# EAGLE design Dash Lights (EAGLE 8.4.1)
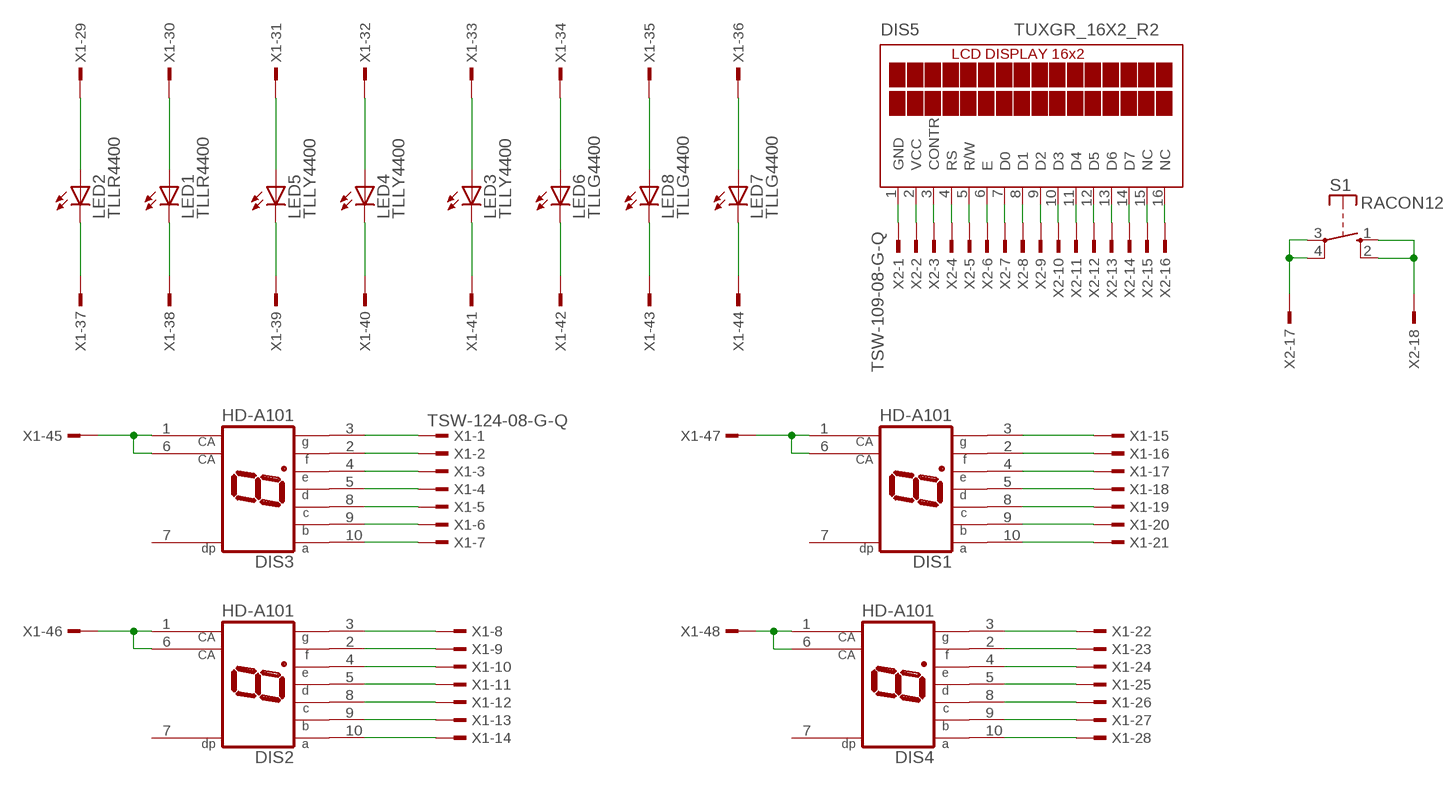
[diagram p0: schematic, sheet 1]

## Parts
DIS1  HD-A101  [HDSP-A]
DIS2  HD-A101  [HDSP-A]
DIS3  HD-A101  [HDSP-A]
DIS4  HD-A101  [HDSP-A]
DIS5  TUXGR_16X2_R2  [TUXGR_16X2_R2]
LED1  TLLR4400  [LED3MM]
LED2  TLLR4400  [LED3MM]
LED3  TLLY4400  [LED3MM]
LED4  TLLY4400  [LED3MM]
LED5  TLLY4400  [LED3MM]
LED6  TLLG4400  [LED3MM]
LED7  TLLG4400  [LED3MM]
LED8  TLLG4400  [LED3MM]
S1  RACON12  [RACON12]
X1  TSW-124-08-G-Q  [TSW-124-XX-G-Q]
X2  TSW-109-08-G-Q  [TSW-109-XX-G-Q]

## Nets
N$1: DIS3.3(G) X1.1
N$2: DIS3.2(F) X1.2
N$3: DIS3.4(E) X1.3
N$4: DIS3.5(D) X1.4
N$5: DIS3.8(C) X1.5
N$6: DIS3.9(B) X1.6
N$7: DIS3.10(A) X1.7
N$8: DIS2.3(G) X1.8
N$9: DIS2.2(F) X1.9
N$10: DIS2.4(E) X1.10
N$11: DIS2.5(D) X1.11
N$12: DIS2.8(C) X1.12
N$13: DIS2.9(B) X1.13
N$14: DIS2.10(A) X1.14
N$15: DIS1.3(G) X1.15
N$16: DIS1.2(F) X1.16
N$17: DIS1.4(E) X1.17
N$18: DIS1.5(D) X1.18
N$19: DIS1.8(C) X1.19
N$20: DIS1.9(B) X1.20
N$21: DIS1.10(A) X1.21
N$22: DIS4.3(G) X1.22
N$23: DIS4.2(F) X1.23
N$24: DIS4.4(E) X1.24
N$25: DIS4.5(D) X1.25
N$26: DIS4.8(C) X1.26
N$27: DIS4.9(B) X1.27
N$28: DIS4.10(A) X1.28
N$29: LED2.A X1.29
N$30: LED2.K(C) X1.37
N$31: LED1.K(C) X1.38
N$32: LED1.A X1.30
N$33: LED5.A X1.31
N$34: LED5.K(C) X1.39
N$35: LED4.A X1.32
N$36: LED4.K(C) X1.40
N$37: LED3.K(C) X1.41
N$38: LED3.A X1.33
N$39: LED6.A X1.34
N$40: LED6.K(C) X1.42
N$41: LED8.K(C) X1.43
N$42: LED7.K(C) X1.44
N$43: LED7.A X1.36
N$44: LED8.A X1.35
N$45: DIS3.1(CA) DIS3.6(CA) X1.45
N$46: DIS2.1(CA) DIS2.6(CA) X1.46
N$47: DIS1.1(CA) DIS1.6(CA) X1.47
N$48: DIS5.1(GND) X2.1
N$49: DIS5.2(VCC) X2.2
N$50: DIS5.3(CONTR) X2.3
N$51: DIS4.1(CA) DIS4.6(CA) X1.48
N$52: DIS5.4(RS) X2.4
N$53: DIS5.5(R/W) X2.5
N$54: DIS5.6(E) X2.6
N$55: DIS5.7(D0) X2.7
N$56: DIS5.8(D1) X2.8
N$57: DIS5.9(D2) X2.9
N$58: DIS5.10(D3) X2.10
N$59: DIS5.11(D4) X2.11
N$60: DIS5.12(D5) X2.12
N$61: DIS5.13(D6) X2.13
N$62: DIS5.14(D7) X2.14
N$63: DIS5.15(NC) X2.15
N$64: DIS5.16(NC) X2.16
N$65: S1.3(P) S1.4(P) X2.17
N$66: S1.1(S) S1.2(S) X2.18
Unconnected: DIS1.7(DP) DIS2.7(DP) DIS3.7(DP) DIS4.7(DP)

## Library data of the parts
DIS1-DIS4 = display-hp:HD-A101: LED DISPLAY 1-character 7 segment, decimal point right; OC_FARNELL: unknown; OC_NEWARK: unknown
DIS5 = display-lcd:TUXGR_16X2_R2: Tuxgraphics LCD display 16x2 characters reflective, without background light Source: tuxgr_12x2_r2.pdf; OC_FARNELL: unknown; OC_NEWARK: unknown
LED1 LED2 = led:TLLR4400: Low Current (2mA) LED 3 mm Tinted Diffused Package color RED Source: Data sheet <http://www.farnell.com/datasheets/391100.pdf>; MF: VISHAY SEMICONDUCTOR; OC_FARNELL: 1612437
LED3-LED5 = led:TLLY4400: Low Current (2mA) LED 3 mm Tinted Diffused Package color YELLOW Source: Data sheet <http://www.farnell.com/datasheets/391098.pdf>; MF: VISHAY SEMICONDUCTOR; OC_FARNELL: 1612439
LED6-LED8 = led:TLLG4400: Low Current (2mA) LED 3 mm Tinted Diffused Package color GREEN Source: Data sheet <http://www.farnell.com/datasheets/391098.pdf>; MF: VISHAY SEMICONDUCTOR; OC_FARNELL: 1612435
S1 = switch-misc:RACON12: ITT SWITCH
X1 = con-samtec:TSW-124-*-G: THROUGH-HOLE .025" SQ POST HEADER Source: Samtec TSW.pdf; MF: Samtec Inc.; MPN: TSW-124-07-G-Q
X2 = con-samtec:TSW-109-*-G: THROUGH-HOLE .025" SQ POST HEADER Source: Samtec TSW.pdf; MF: Samtec Inc.; MPN: TSW-109-07-G-Q

## Board
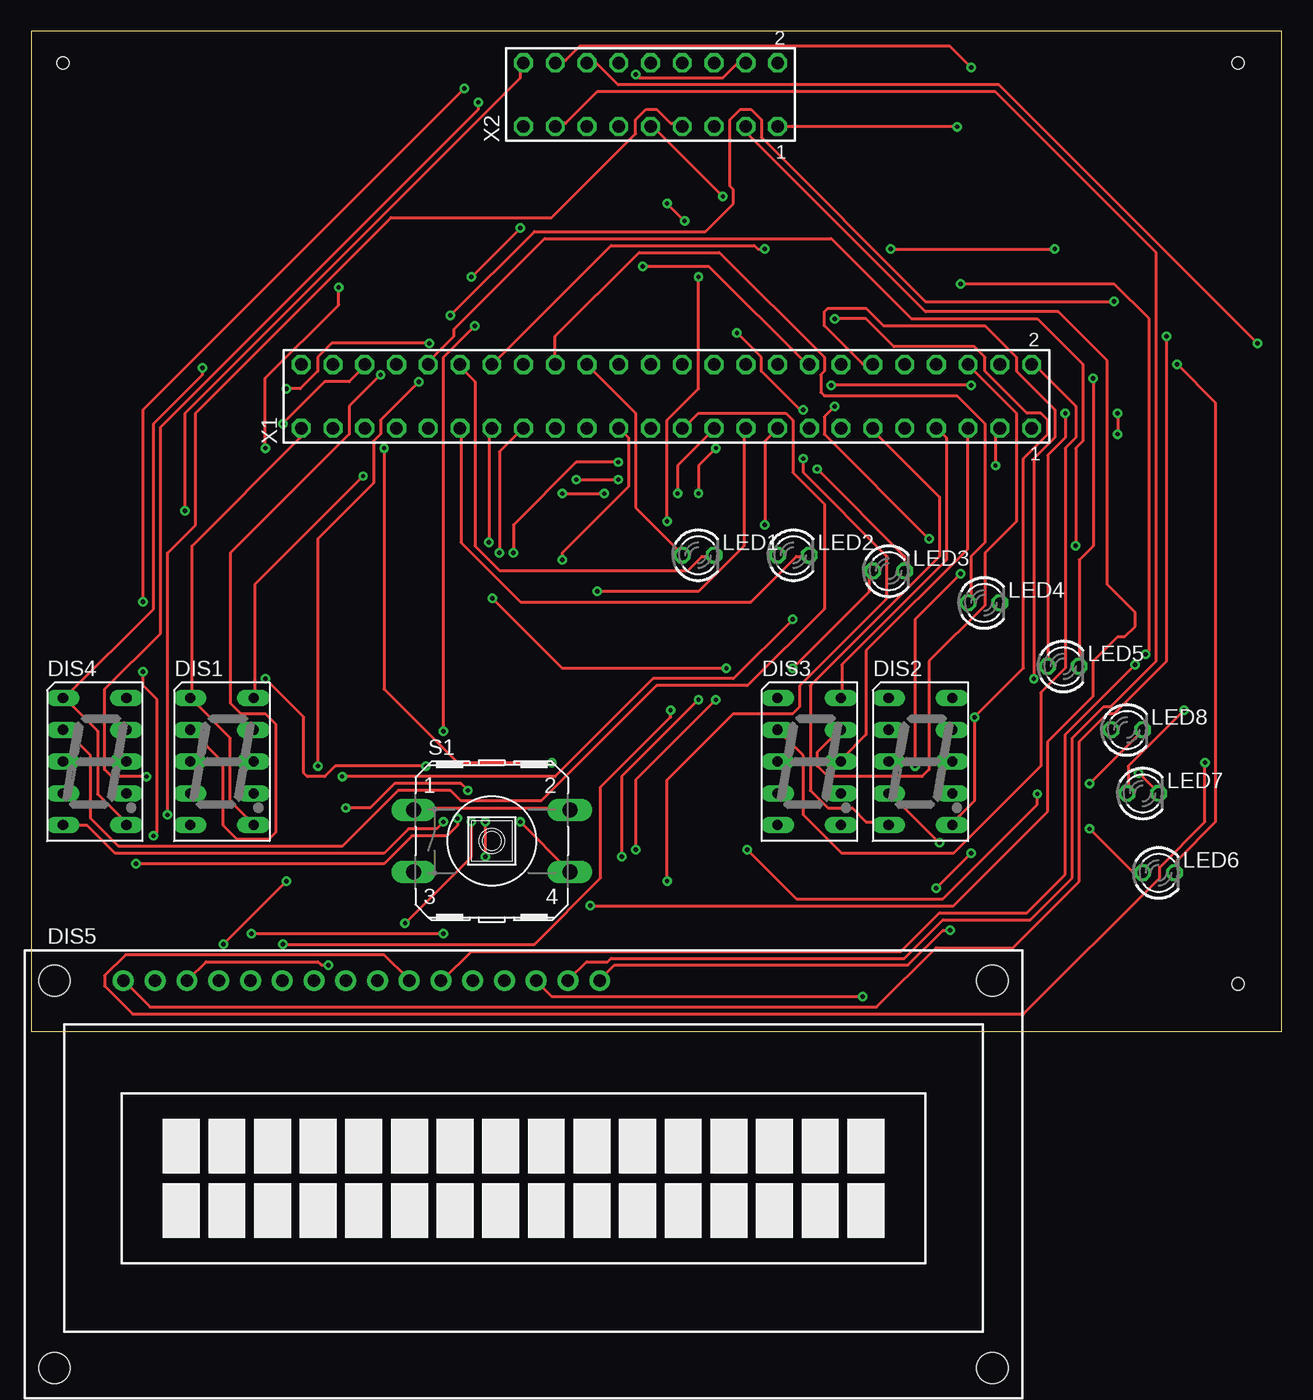
[diagram p1: board, top side]
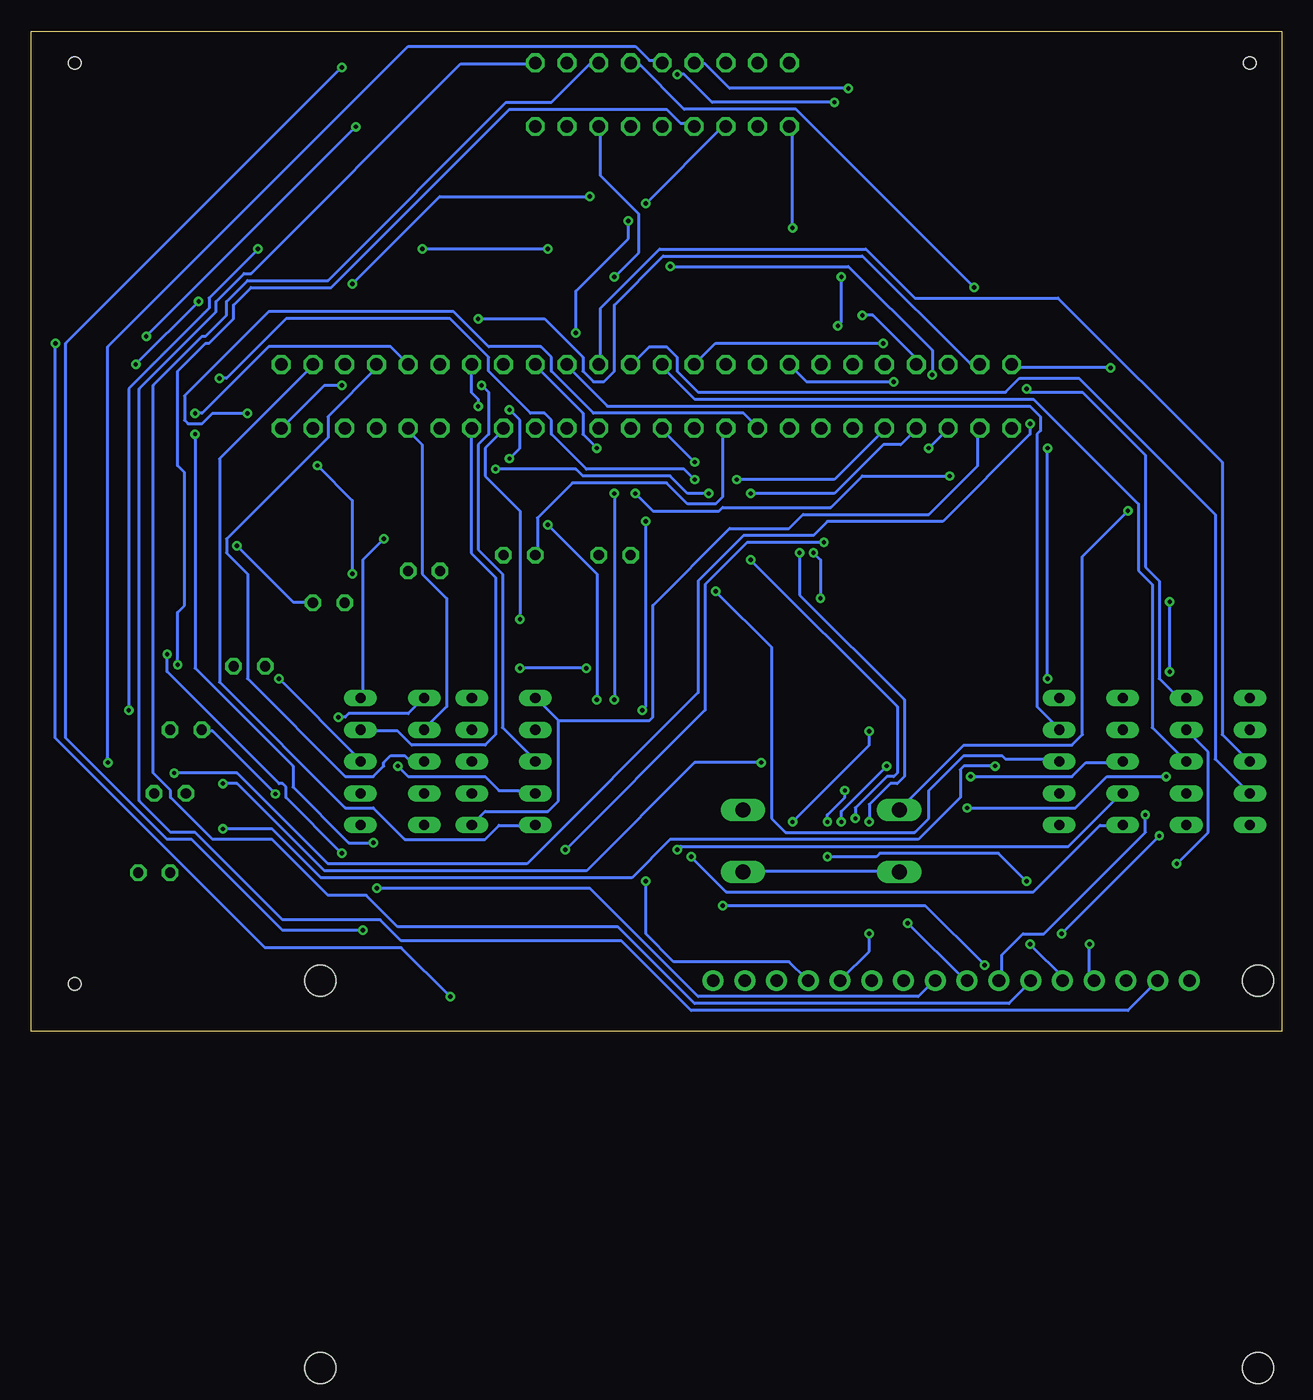
[diagram p2: board, bottom side, seen from below]

Size 100 x 80 mm. Coordinates in mm from the lower left corner, seen from the top.
Outline: 0,0 100,0 100,80 0,80 0,0
Copper layers (1*16): Top 0.035mm / dielectric 1.5mm / Bottom 0.035mm
Design rules "default *": minimum track width 10mil, minimum drill 0.35mm, track to track 12mil, track to pad 12mil, pad to pad 12mil, via to via 12mil, smd to smd 6mil, copper to edge 40mil, drill to drill 6mil, minimum pad ring 10mil, minimum via ring 8mil, stop-mask expansion 4mil, vias tented up to drill 0mil, thermal gap 10mil
Holes 1 mm at 2.54,77.47 96.52,77.47 96.52,3.81

### Footprints (pad centres in the part's own frame; a part is rotated, then mirrored left to right if it is on the bottom)
HDSP-A = drill 0.813 long: 1 -2.54,5.08; 2 -2.54,2.54; 3 -2.54,0; 4 -2.54,-2.54; 5 -2.54,-5.08; 6 2.54,-5.08; 7 2.54,-2.54; 8 2.54,0; 9 2.54,2.54; 10 2.54,5.08
TUXGR_16X2_R2 = drill 1 pad 1.676: 1 -32,15.5; 2 -29.46,15.5; 3 -26.92,15.5; 4 -24.38,15.5; 5 -21.84,15.5; 6 -19.3,15.5; 7 -16.76,15.5; 8 -14.22,15.5; 9 -11.68,15.5; 10 -9.14,15.5; 11 -6.6,15.5; 12 -4.06,15.5; 13 -1.52,15.5; 14 1.02,15.5; 15 3.56,15.5; 16 6.1,15.5 | hole 2.5: -37.5,-15.5; 37.5,-15.5; -37.5,15.5; 37.5,15.5
LED3MM = drill 0.813 octagon: A -1.27,0; K 1.27,0
RACON12 = drill 1.194 long: 1 -6.248,2.489; 2 6.248,2.489; 3 -6.248,-2.489; 4 6.248,-2.489
TSW-124-XX-G-Q = drill 1 pad 1.5 octagon: 1 29.21,-2.54; 2 29.21,2.54; 3 26.67,-2.54; 4 26.67,2.54; 5 24.13,-2.54; 6 24.13,2.54; 7 21.59,-2.54; 8 21.59,2.54; 9 19.05,-2.54; 10 19.05,2.54; 11 16.51,-2.54; 12 16.51,2.54; 13 13.97,-2.54; 14 13.97,2.54; 15 11.43,-2.54; 16 11.43,2.54; 17 8.89,-2.54; 18 8.89,2.54; 19 6.35,-2.54; 20 6.35,2.54; 21 3.81,-2.54; 22 3.81,2.54; 23 1.27,-2.54; 24 1.27,2.54; 25 -1.27,-2.54; 26 -1.27,2.54; 27 -3.81,-2.54; 28 -3.81,2.54; 29 -6.35,-2.54; 30 -6.35,2.54; 31 -8.89,-2.54; 32 -8.89,2.54; 33 -11.43,-2.54; 34 -11.43,2.54; 35 -13.97,-2.54; 36 -13.97,2.54; 37 -16.51,-2.54; 38 -16.51,2.54; 39 -19.05,-2.54; 40 -19.05,2.54; 41 -21.59,-2.54; 42 -21.59,2.54; 43 -24.13,-2.54; 44 -24.13,2.54; 45 -26.67,-2.54; 46 -26.67,2.54; 47 -29.21,-2.54; 48 -29.21,2.54
TSW-109-XX-G-Q = drill 1 pad 1.5 octagon: 1 10.16,-2.54; 2 10.16,2.54; 3 7.62,-2.54; 4 7.62,2.54; 5 5.08,-2.54; 6 5.08,2.54; 7 2.54,-2.54; 8 2.54,2.54; 9 0,-2.54; 10 0,2.54; 11 -2.54,-2.54; 12 -2.54,2.54; 13 -5.08,-2.54; 14 -5.08,2.54; 15 -7.62,-2.54; 16 -7.62,2.54; 17 -10.16,-2.54; 18 -10.16,2.54

### Placement (x,y rotation side)
DIS1  15.24,21.59 0 top
DIS2  71.12,21.59 0 top
DIS3  62.23,21.59 0 top
DIS4  5.08,21.59 0 top
DIS5  39.37,-11.43 0 top
LED1  53.34,38.1 0 top
LED2  60.96,38.1 0 top
LED3  68.58,36.83 0 top
LED4  76.2,34.29 0 top
LED5  82.55,29.21 0 top
LED6  90.17,12.7 0 top
LED7  88.9,19.05 0 top
LED8  87.63,24.13 0 top
S1  36.83,15.24 0 top
X1  50.8,50.8 0 top
X2  49.53,74.93 0 top

### Tracks (layer width: path | path; a pad name or v marks a point on that pad's centre or on a via)
N$1  (via drill 0.35)
  Top 0.254: v75.16,51.69 v63.98,51.69
  Bottom 0.254: v63.98,51.69 63.42,51.13 63.42,47.78 64.26,46.94 64.26,38.56 62.31,36.6 62.31,24.31 59.79,21.79 DIS3.3 | v75.16,51.69 76.56,51.69 79.91,48.34 X1.1
N$2
  Top 0.254: DIS3.2 61.75,22.07 61.75,17.32 64.82,14.25 73.76,14.25 80.75,21.23 80.75,27.1 82.7,29.06 82.7,46.66 83.54,47.5 83.54,50.01 80.19,53.37 X1.2
N$3  (via drill 0.35)
  Top 0.254: v70.69,21.23 70.69,32.97 v74.32,36.6 | v77.11,45.26 77.11,47.78 77.39,48.06 X1.3
  Bottom 0.254: v70.69,21.23 69.85,20.4 63.7,20.4 62.59,19.28 59.79,19.28 DIS3.4 | v74.32,36.6 74.32,42.47 v77.11,45.26
N$4
  Bottom 0.254: DIS3.5 59.79,16.48 62.59,16.48 63.7,15.37 70.13,15.37 72.64,17.88 74.88,17.88 84.94,27.94 84.94,45.82 77.67,53.09 X1.4
N$5
  Top 0.254: DIS3.8 64.82,21.79 66.78,23.75 66.78,30.45 74.88,38.56 74.88,48.06 X1.5
N$6
  Top 0.254: DIS3.9 64.54,24.03 62.87,22.35 62.87,21.23 63.7,20.4 71.25,20.4 71.81,20.95 71.81,29.62 76.28,34.09 76.28,38.28 78.79,40.79 78.79,49.45 75.16,53.09 X1.6
N$7
  Top 0.254: DIS3.10 64.82,26.82 64.82,29.34 73.2,37.72 73.2,47.5 72.64,48.06 X1.7
N$8
  Bottom 0.254: DIS2.3 68.73,21.79 69.85,21.79 70.13,22.07 71.25,22.07 71.81,21.51 71.81,21.23 72.64,20.4 74.88,20.4 82.7,28.22 82.7,36.6 84.38,38.28 84.38,39.4 76.28,47.5 76.28,49.17 72.36,53.09 X1.8
N$9
  Bottom 0.254: DIS2.2 68.45,24.31 66.78,25.98 66.78,34.65 68.73,36.6 68.73,46.94 69.85,48.06 X1.9
N$10  (via drill 0.35)
  Top 0.254: v72.64,15.09 68.73,19 DIS2.4 | v86.89,49.45 v86.89,47.78
  Bottom 0.254: v72.64,15.09 74.6,15.09 79.07,19.56 79.07,21.23 86.89,29.06 v86.89,47.78 | v86.89,49.45 86.33,49.45 81.03,54.76 71.25,54.76 69.85,53.37 X1.10
N$11
  Top 0.254: DIS2.5 68.45,16.76 66.78,16.76 65.66,17.88 63.7,17.88 62.31,19.28 62.31,27.66 72.64,38 72.64,42.75 67.33,48.06 X1.11
N$12  (via drill 0.35)
  Top 0.254: v80.19,28.22 80.19,45.82 81.86,47.5 81.86,49.73 78.79,52.81 78.79,53.92 76.28,56.44 68.17,56.44 66.78,57.84 63.7,57.84 63.42,57.56 63.42,56.44 66.5,53.37 67.06,53.37 X1.12
  Bottom 0.254: v80.19,28.22 73.76,21.79 DIS2.8
N$13
  Bottom 0.254: DIS2.9 73.48,24.03 70.69,24.03 69.57,22.91 63.7,22.91 62.87,23.75 62.87,36.32 64.82,38.28 64.82,48.06 X1.13
N$14  (via drill 0.35)
  Top 0.254: v71.81,39.4 63.42,47.78 63.42,49.17 v64.26,50.01
  Bottom 0.254: v71.81,39.4 73.48,37.72 73.48,26.82 DIS2.10 | v64.26,50.01 64.26,50.57 64.82,51.13 64.82,53.09 X1.14
N$15  (via drill 0.35)
  Top 0.254: v24.87,20.4 41.91,20.4 49.73,28.22 56.16,28.22 v60.91,32.97
  Bottom 0.254: v24.87,20.4 16.76,20.4 15.65,21.51 12.85,21.51 DIS1.3 | v60.91,32.97 60.91,41.63 63.7,44.42 63.7,46.66 62.31,48.06 X1.15
N$16  (via drill 0.35)
  Top 0.254: v27.94,52.53 25.43,50.01 25.43,47.78 15.93,38.28 15.93,26.26 16.76,25.43 18.72,25.43 19.56,24.59 19.56,15.93 19,15.37 16.48,15.37 15.37,16.48 15.37,21.51 12.85,24.03 DIS1.2 | v48.9,61.19 54.2,61.19 62.03,53.37 X1.16
  Bottom 0.254: v27.94,52.53 27.94,54.48 34.65,61.19 v48.9,61.19
N$17  (via drill 0.35)
  Top 0.254: v48.34,14.53 48.34,20.12 v54.76,26.54 | v58.67,40.51 58.67,47.22 59.51,48.06 X1.17
  Bottom 0.254: v48.34,14.53 48.06,14.81 17.04,14.81 12.85,19 DIS1.4 | v54.76,26.54 54.76,36.6 v58.67,40.51
N$18  (via drill 0.35)
  Top 0.254: v47.22,13.97 47.22,20.4 v53.37,26.54 | v53.37,43.03 53.37,45.26 v54.76,46.66
  Bottom 0.254: v47.22,13.97 44.42,11.18 19.84,11.18 14.53,16.48 12.85,16.48 DIS1.5 | v53.37,43.03 v53.37,26.54 | v54.76,46.66 55.88,47.78 55.88,49.45 59.51,53.09 X1.18
N$19  (via drill 0.35)
  Top 0.254: v45.26,35.2 53.37,35.2 57,38.84 57,48.06 X1.19
  Bottom 0.254: v45.26,35.2 40.79,30.73 40.79,17.04 39.67,15.93 29.34,15.93 28.22,17.04 28.22,19.28 25.43,22.07 22.35,22.07 22.07,21.79 17.88,21.79 DIS1.8
N$20
  Bottom 0.254: DIS1.9 17.88,24.31 19.56,25.98 19.56,47.78 19.28,48.06 19.28,49.17 20.12,50.01 53.92,50.01 57,53.09 X1.20
N$21  (via drill 0.35)
  Top 0.254: v26.54,44.42 17.88,35.76 17.88,26.82 DIS1.10 | v51.69,43.03 51.69,45.26 54.48,48.06 X1.21
  Bottom 0.254: v26.54,44.42 33.53,44.42 36.04,41.91 44.7,41.91 44.98,41.63 50.29,41.63 v51.69,43.03
N$22
  Bottom 0.254: DIS4.3 2.79,21.79 4.75,23.75 4.75,45.54 17.88,58.67 29.34,58.67 33.25,62.59 49.73,62.59 54.48,57.84 54.48,53.37 X1.22
N$23
  Top 0.254: DIS4.2 2.79,24.03 4.75,22.07 4.75,17.04 6.99,14.81 24.87,14.81 29.34,19.28 33.53,19.28 34.37,18.44 40.79,18.44 50.01,27.66 57.28,27.66 63.42,33.81 63.42,42.19 60.91,44.7 60.91,48.9 60.35,49.45 53.37,49.45 52.25,48.34 X1.23
N$24
  Bottom 0.254: DIS4.4 2.79,19.28 5.31,21.79 5.31,41.35 16.2,52.25 20.95,52.25 22.07,51.13 46.66,51.13 48.34,52.81 48.34,53.92 49.17,54.76 50.57,54.76 51.97,53.37 X1.24
N$25  (via drill 0.35)
  Top 0.254: v32.97,16.76 32.41,16.2 30.18,16.2 28.22,14.25 6.71,14.25 4.47,16.48 2.79,16.48 DIS4.5 | v38.56,38.28 38.56,40.51 43.59,45.54 v46.94,45.54
  Bottom 0.254: v32.97,16.76 32.97,18.16 31.29,19.84 30.73,19.84 30.18,20.4 30.18,26.54 38.56,34.92 v38.56,38.28 | v46.94,45.54 49.45,48.06 X1.25
N$26
  Bottom 0.254: DIS4.8 10.34,24.31 10.34,35.76 11.46,36.88 11.46,42.19 19.84,50.57 46.94,50.57 49.45,53.09 X1.26
N$27  (via drill 0.35)
  Top 0.254: v8.38,13.41 28.22,13.41 30.45,15.65 33.25,15.65 34.09,16.48 v34.09,17.04 | v42.47,37.72 42.47,38.28 47.78,43.59 47.78,47.5 47.22,48.06 X1.27
  Bottom 0.254: v8.38,13.41 5.87,15.93 5.87,22.35 7.54,24.03 DIS4.9 | v34.09,17.04 34.09,17.88 31.57,20.4 31.01,20.4 30.73,20.68 30.73,25.98 v42.47,37.72
N$28  (via drill 0.35)
  Top 0.254: v20.4,51.41 21.51,51.41 22.91,52.81 22.91,53.92 24.03,55.04 v31.85,55.04
  Bottom 0.254: v20.4,51.41 20.12,51.13 15.93,51.13 10.9,46.1 10.9,37.16 9.78,36.04 9.78,28.22 8.38,26.82 7.82,26.82 DIS4.10 | v31.85,55.04 45.26,55.04 46.94,53.37 X1.28
N$29
  Bottom 0.254: LED2.A 59.51,38.28 59.51,41.07 56.72,43.87 49.17,43.87 47.5,42.19 45.26,42.19 44.7,42.75 44.7,48.06 X1.29
N$30
  Top 0.254: LED2.K 62.03,38 61.19,38 57.56,34.37 39.12,34.37 34.37,39.12 34.37,48.06 X1.37
N$31
  Top 0.254: LED1.K 54.48,38 53.65,38 52.53,36.88 37.44,36.88 35.48,38.84 35.48,51.97 34.37,53.09 X1.38
N$32
  Top 0.254: X1.30 48.34,49.45 48.34,41.91 51.97,38.28 LED1.A
N$33  (via drill 0.35)
  Top 0.254: v82.7,49.45 82.7,47.5 81.31,46.1 81.31,29.34 LED5.A
  Bottom 0.254: v82.7,49.45 85.5,49.45 86.33,48.62 87.45,48.62 87.73,48.9 87.73,50.85 81.03,57.56 66.22,57.56 63.42,54.76 59.23,54.76 58.4,53.92 58.4,52.81 55.04,49.45 43.03,49.45 41.91,48.34 X1.31
N$34  (via drill 0.35)
  Top 0.254: LED5.K 83.82,37.72 84.94,38.84 v84.94,52.25 | v43.59,44.15 v46.94,44.15
  Bottom 0.254: v84.94,52.25 84.38,52.25 79.63,57 66.5,57 63.42,53.92 63.42,52.81 60.07,49.45 58.95,49.45 58.4,48.9 58.4,47.78 55.6,44.98 47.78,44.98 v46.94,44.15 | v43.59,44.15 35.76,44.15 31.85,48.06 X1.39
N$35
  Top 0.254: X1.32 41.91,55.6 48.62,62.31 55.04,62.31 63.42,53.92 63.42,52.81 63.14,52.53 63.14,51.13 63.42,50.85 74.04,50.85 76.28,48.62 76.28,39.12 75.16,38 75.16,34.37 LED4.A
N$36  (via drill 0.35)
  Top 0.254: v83.54,38.84 83.54,46.66 84.1,47.22 84.1,53.37 80.47,57 70.41,57 63.98,63.42 41.07,63.42 33.81,56.16 33.81,55.6 31.57,53.37 X1.40
  Bottom 0.254: v83.54,38.84 79.07,34.37 77.67,34.37 LED4.K
N$37  (via drill 0.35)
  Top 0.254: LED3.K 69.85,38 v62.87,44.98 | v42.47,43.03 v45.82,43.03
  Bottom 0.254: v62.87,44.98 56.44,44.98 55.88,44.42 48.9,44.42 47.5,43.03 v45.82,43.03 | v42.47,43.03 35.76,43.03 31.85,46.94 30.45,46.94 29.34,48.06 X1.41
N$38  (via drill 0.35)
  Top 0.254: v60.91,29.06 67.06,35.2 67.06,36.6 LED3.A | v55.6,29.06 42.47,29.06 v36.88,34.65 | v37.44,38.28 37.44,46.38 39.12,48.06 X1.33
  Bottom 0.254: v55.6,29.06 v60.91,29.06 | v36.88,34.65 36.88,37.72 v37.44,38.28
N$39  (via drill 0.35)
  Top 0.254: v84.66,16.2 88.01,12.85 88.85,12.85 LED6.A | v22.91,21.23 22.91,39.4 27.38,43.87 27.38,47.22 27.94,47.78 27.94,48.9 v31.01,51.97
  Bottom 0.254: v84.66,16.2 80.75,16.2 76.83,12.29 51.97,12.29 48.9,15.37 29.06,15.37 25.7,18.72 25.7,20.95 25.43,21.23 v22.91,21.23 | v31.01,51.97 38,51.97 X1.34
N$40  (via drill 0.35)
  Top 0.254: v91.64,53.37 94.72,50.29 94.72,16.76 91.64,13.69 91.64,12.85 LED6.K | v86.61,58.4 71.53,58.4 58.4,71.53 58.4,72.92 57.56,73.76 56.72,73.76 55.88,72.92 55.88,67.61 56.16,67.33 56.16,66.22 53.92,63.98 40.23,63.98 v33.53,57.28
  Bottom 0.254: v86.61,58.4 v91.64,53.37 | v33.53,57.28 32.69,57.28 29.34,53.92 29.34,53.37 X1.42
N$41  (via drill 0.35)
  Top 0.254: v84.66,19.84 88.85,24.03 LED8.K | v41.63,21.51 34.09,21.51 28.22,27.38 v28.22,46.66
  Bottom 0.254: v84.66,19.84 83.54,19.84 76.56,12.85 55.6,12.85 46.94,21.51 v41.63,21.51 | v28.22,46.66 26.82,48.06 X1.43
N$42  (via drill 0.35)
  Top 0.254: v88.57,20.68 89.97,19.28 LED7.K | v20.12,48.62 23.47,51.97 25.43,51.97 26.54,53.09 X1.44
  Bottom 0.254: v88.57,20.68 83.54,20.68 76.28,13.41 60.35,13.41 46.66,27.1 46.66,36.04 43.03,39.67 37.44,39.67 36.32,40.79 27.1,40.79 20.12,47.78 v20.12,48.62
N$43  (via drill 0.35)
  Top 0.254: v92.2,25.7 87.73,21.23 87.73,19.28 LED7.A | v68.73,62.59 v81.86,62.59 | v58.67,62.59 58.12,62.59 57.84,62.87 46.38,62.87 36.88,53.37 X1.36
  Bottom 0.254: v92.2,25.7 92.2,51.41 85.78,57.84 85.78,58.67 v81.86,62.59 | v58.67,62.59 v68.73,62.59
N$44  (via drill 0.35)
  Top 0.254: v80.47,19 80.47,18.16 72.92,10.62 61.19,10.62 v57.28,14.53 | v36.6,39.12 36.6,48.06 X1.35
  Bottom 0.254: v80.47,19 85.5,24.03 86.33,24.03 LED8.A | v57.28,14.53 46.1,25.7 46.1,35.76 42.75,39.12 v36.6,39.12
N$45
  Bottom 0.254: 57.84,24.87 59.51,26.54 DIS3.1 | 57.84,24.87 57.84,18.44 58.67,17.6 63.7,17.6 64.54,16.76 DIS3.6 | 57.84,24.87 50.57,24.87 50.29,25.15 50.29,34.09 44.15,40.23 39.4,40.23 38.28,41.35 28.22,41.35 24.31,45.26 24.31,48.06 X1.45
N$46  (via drill 0.35)
  Top 0.254: DIS2.6 73.76,16.76 75.44,18.44 v75.44,25.15 79.35,29.06 79.35,45.82 81.31,47.78 81.31,48.9 80.75,49.45 79.63,49.45 76.28,52.81 76.28,53.92 75.44,54.76 69.01,54.76 66.78,57 v64.26,57
  Bottom 0.254: v75.44,25.15 74.88,25.15 74.6,25.43 69.85,25.43 68.73,26.54 DIS2.1 | v64.26,57 58.95,57 55.88,53.92 55.88,52.81 55.04,51.97 54.2,51.97 53.37,52.81 53.37,58.12 49.45,62.03 33.53,62.03 24.87,53.37 24.31,53.37 X1.46
N$47
  Top 0.254: DIS1.6 17.6,16.76 15.93,18.44 15.93,23.47 12.85,26.54 DIS1.1 12.85,26.82 12.85,38.84 21.51,47.5 21.51,48.06 X1.47
N$48  (via drill 0.35)
  Top 0.254: v74.04,72.36 59.79,72.36 X2.1 | v90.81,55.6 90.81,29.62 86.61,25.43 86.06,25.43 83.82,23.19 83.82,12.01 78.51,6.71 72.36,6.71 67.61,1.96 9.5,1.96 7.54,3.91 DIS5.1
  Bottom 0.254: v90.81,55.6 v74.04,72.36
N$49
  Bottom 0.254: X2.2 59.79,77.39 65.66,77.39 82.42,60.63 82.98,60.63 85.22,58.4 85.22,57.56 91.36,51.41 91.36,18.44 88.85,15.93 86.89,15.93 79.91,8.94 72.08,8.94 70.41,7.26 52.81,7.26 47.22,1.68 12.29,1.68 10.06,3.91 DIS5.2
N$50  (via drill 0.35)
  Top 0.254: v44.7,10.06 73.76,10.06 81.31,17.6 81.31,23.19 84.94,26.82 84.94,29.62 86.89,31.57 87.45,31.57 88.29,32.41 88.29,33.53 86.06,35.76 86.06,53.65 82.14,57.56 71.53,57.56 57.28,71.81 57.28,72.36 X2.3 | v23.75,5.31 23.19,5.31 22.91,5.59 13.97,5.59 12.57,4.19 DIS5.3
  Bottom 0.254: v44.7,10.06 28.5,10.06 v23.75,5.31
N$51  (via drill 0.35)
  Top 0.254: DIS4.6 7.54,16.76 5.31,19 5.31,24.03 2.79,26.54 DIS4.1 2.79,26.82 9.78,33.81 9.78,48.62 13.69,52.53 v13.69,53.09
  Bottom 0.254: v13.69,53.09 21.51,53.09 X1.48
N$52  (via drill 0.35)
  Top 0.254: v48.34,76.56 48.62,76.28 55.32,76.28 56.44,77.39 57,77.39 X2.4 | v35.76,74.32 35.76,73.76 10.34,48.34 10.34,31.85 5.87,27.38 5.87,20.95 6.43,20.4 v9.22,20.4 | v25.15,17.88 27.1,17.88 29.06,19.84 34.37,19.84 v34.92,19.28 | v36.32,13.97 v36.32,16.76 | v15.37,6.99 v20.4,12.01
  Bottom 0.254: v48.34,76.56 47.78,76.56 45.54,74.32 v35.76,74.32 | v9.22,20.4 13.97,20.4 16.48,17.88 v25.15,17.88 | v34.92,19.28 34.92,18.72 36.32,17.32 v36.32,16.76 | v36.32,13.97 32.41,13.97 32.13,14.25 22.63,14.25 v20.4,12.01 | v15.37,6.99 15.37,4.47 15.09,4.19 DIS5.4
N$53  (via drill 0.35)
  Top 0.254: v53.37,60.35 53.37,51.41 50.85,48.9 v50.85,40.79 | v51.13,25.7 51.13,25.15 45.54,19.56 45.54,12.29 40.23,6.99 v20.12,6.99
  Bottom 0.254: v53.37,60.35 51.41,62.31 51.41,65.38 54.48,68.45 54.48,72.36 X2.5 | v50.85,40.79 50.85,25.98 v51.13,25.7 | v20.12,6.99 17.32,4.19 DIS5.5
N$54
  Bottom 0.254: X2.6 54.76,77.39 55.32,77.39 58.4,74.32 62.03,74.32 76.28,60.07 82.7,60.07 84.38,58.4 84.38,57.28 86.06,55.6 86.33,55.6 90.25,51.69 90.25,20.68 88.85,19.28 88.85,18.72 85.5,15.37 80.75,15.37 76.28,10.9 73.2,10.9 70.69,8.38 53.09,8.38 46.94,2.23 21.79,2.23 20.12,3.91 DIS5.6
N$55  (via drill 0.35)
  Top 0.254: v10.9,17.32 10.9,38.28 13.13,40.51 13.13,49.45 28.78,65.1 41.63,65.1 48.34,71.81 48.34,72.92 49.17,73.76 50.01,73.76 51.13,72.64 51.97,72.64 X2.7
  Bottom 0.254: v10.9,17.32 10.9,15.93 19,7.82 20.68,7.82 22.35,6.15 22.35,4.19 DIS5.7
N$56  (via drill 0.35)
  Top 0.254: v24.59,59.51 24.59,58.12 18.72,52.25 v18.72,46.66 | v18.72,28.22 21.79,25.15 21.79,20.68 22.07,20.4 23.47,20.4 24.31,21.23 v31.57,21.23 | v35.2,16.76 35.2,13.97 v29.9,8.66
  Bottom 0.254: v24.59,59.51 38.84,73.76 47.78,73.76 51.41,77.39 51.97,77.39 X2.8 | v18.72,28.22 v18.72,46.66 | v31.57,21.23 35.2,17.6 v35.2,16.76 | v29.9,8.66 25.43,4.19 DIS5.8
N$57  (via drill 0.35)
  Top 0.254: v55.32,66.78 49.73,72.36 X2.9 | v74.32,59.79 86.61,59.79 89.41,57 89.41,30.45 v89.13,30.18 | v72.36,11.46 v75.16,14.25
  Bottom 0.254: v55.32,66.78 67.33,66.78 v74.32,59.79 | v89.13,30.18 89.13,28.78 80.19,19.84 79.91,19.84 79.63,19.56 79.63,18.72 v75.16,14.25 | v72.36,11.46 55.32,11.46 46.66,2.79 29.06,2.79 27.94,3.91 DIS5.9
N$58  (via drill 0.35)
  Top 0.254: v93.88,21.51 93.88,16.76 90.25,13.13 90.25,12.29 79.35,1.4 8.1,1.4 5.87,3.63 5.87,4.47 7.54,6.15 28.22,6.15 30.18,4.19 DIS5.10
  Bottom 0.254: v93.88,21.51 93.88,54.76 69.85,78.79 51.69,78.79 50.57,77.67 49.73,77.67 X2.10
N$59  (via drill 0.35)
  Top 0.254: v88.29,29.34 82.7,23.75 82.7,12.57 79.63,9.5 72.64,9.5 69.57,6.43 35.2,6.43 32.97,4.19 DIS5.11
  Bottom 0.254: v88.29,29.34 88.29,33.53 87.73,34.09 87.73,44.7 88.29,45.26 88.29,52.81 86.06,55.04 85.78,55.04 83.82,57 83.82,58.12 82.42,59.51 76,59.51 61.75,73.76 49.17,73.76 48.06,72.64 47.22,72.64 X2.11
N$60  (via drill 0.35)
  Top 0.254: v34.65,75.44 8.94,49.73 v8.94,34.37 | v8.94,28.78 8.94,27.66 10.06,26.54 10.06,15.93 v9.78,15.65 | v32.97,7.82 v17.6,7.82
  Bottom 0.254: v34.65,75.44 44.15,75.44 46.1,77.39 46.94,77.39 X2.12 | v8.94,28.78 v8.94,34.37 | v17.6,7.82 v9.78,15.65 | v32.97,7.82 32.97,6.43 35.2,4.19 DIS5.12
N$61  (via drill 0.35)
  Top 0.254: v52.25,64.82 v50.85,66.22 | v56.44,55.88 58.4,53.92 58.4,52.81 61.47,49.73 v61.75,49.73 | v61.75,45.82 61.75,44.7 68.45,38 68.45,34.65 61.47,27.66 61.47,25.98 60.91,25.43 56.16,25.43 50.85,20.12 v50.85,12.01
  Bottom 0.254: v50.85,66.22 44.7,72.36 X2.13 | v52.25,64.82 52.25,63.42 56.44,59.23 v56.44,55.88 | v61.75,49.73 60.91,48.9 60.91,46.66 v61.75,45.82 | v50.85,12.01 50.85,7.82 48.62,5.59 39.4,5.59 38,4.19 DIS5.13
N$62  (via drill 0.35)
  Top 0.254: v98.07,55.04 77.39,75.72 46.94,75.72 45.26,77.39 44.7,77.39 X2.14 | v66.5,2.79 41.63,2.79 40.51,3.91 DIS5.14
  Bottom 0.254: v98.07,55.04 98.07,23.47 81.31,6.71 70.41,6.71 v66.5,2.79
N$63
  Top 0.254: X2.15 41.91,72.64 42.75,72.64 45.26,75.16 77.11,75.16 89.97,62.31 89.97,29.62 86.33,25.98 85.78,25.98 83.26,23.47 83.26,12.29 79.91,8.94 72.92,8.94 69.85,5.87 46.38,5.87 46.1,5.59 44.42,5.59 43.03,4.19 DIS5.15
N$64  (via drill 0.35)
  Top 0.254: v75.16,77.11 73.48,78.79 43.87,78.79 42.75,77.67 41.91,77.67 X2.16 | v73.48,8.1 72.92,8.1 70.13,5.31 46.66,5.31 45.54,4.19 DIS5.16
  Bottom 0.254: v75.16,77.11 97.23,55.04 97.23,23.47 89.13,15.37 87.17,15.37 79.91,8.1 v73.48,8.1
N$65  (via drill 0.35)
  Top 0.254: v35.2,60.35 v39.12,64.26 | v35.48,56.44 32.97,53.92 v32.97,24.03 | v39.12,16.76 43.03,12.85 S1.4
  Bottom 0.254: v39.12,64.26 39.12,72.36 X2.17 | v35.2,60.35 35.2,56.72 v35.48,56.44 | v32.97,24.03 32.97,22.91 v39.12,16.76 | S1.3 30.73,12.85 43.03,12.85 S1.4
N$66  (via drill 0.35)
  Top 0.254: v12.29,41.63 12.29,49.45 39.12,76.28 39.12,77.39 X2.18 | S1.2 43.03,17.88 30.73,17.88 S1.1
  Bottom 0.254: v12.29,41.63 15.93,38 15.93,23.75 16.76,22.91 25.43,22.91 30.45,17.88 S1.1

### Text on the board
Measures: 18 | 2 | 17 | 1 | 48 | 2 | 47 | 1